# Altium schematic sheet MCU.SchDoc: Radio Pod - Microcontroller
size A4
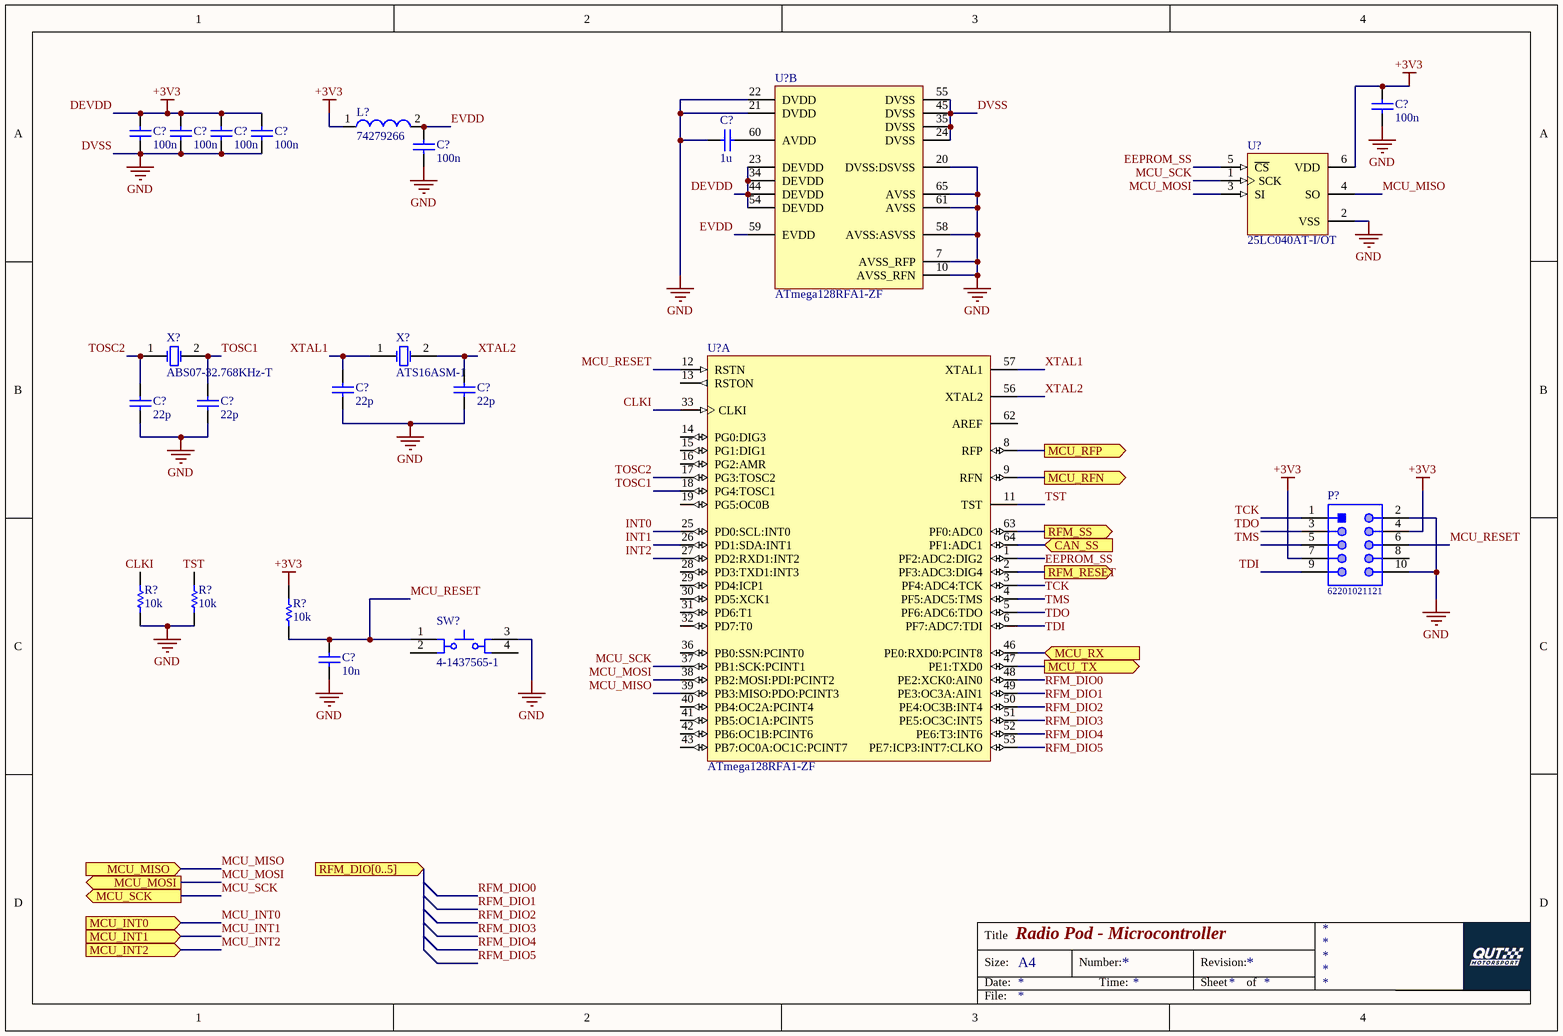
[diagram p0: MCU.SchDoc]

## Parts
(Parts that share a designator on the sheet are numbered #1, #2 ... from top to bottom, then left to right.)
C?#1  100n  [CAPC1608X90X35ML10T15]
C?#2  100n  [CAPC1608X90X35ML10T15]
C?#3  100n  [CAPC1608X90X35ML10T15]
C?#4  100n  [CAPC1608X90X35ML10T15]
C?#5  100n  [CAPC1608X90X35ML10T15]
C?#6  100n  [CAPC1608X90X35ML10T15]
C?#7  1u  [CAPC1608X90X35LL15T15]
C?#8  22p  [CAPC2013X88X50ML20T25]
C?#9  22p  [CAPC2013X88X50ML20T25]
C?#10  22p  [CAPC2013X88X50ML20T25]
C?#11  22p  [CAPC2013X88X50ML20T25]
C?#12  10n  [CAPC1005X56X25LL10T15]
L?  74279266  [SMD-0603]
P?  62201021121  [62201021121]
R?#1  10k  [RESC1609X55X30LL15T15]
R?#2  10k  [RESC1609X55X30LL15T15]
R?#3  10k  [RESC1609X55X30LL15T15]
SW?  4-1437565-1  [TECO-4-1437565-1_V]
U?#1  ATmega128RFA1-ZF  [64PI_N]  (part B of 2)
U?#2  25LC040AT-I/OT  [SOT-23-OT6_N]
U?#3  ATmega128RFA1-ZF  [64PI_N]  (part A of 2)
X?#1  ABS07-32.768KHz-T  [ABRA-ABS07-2_V]
X?#2  ATS16ASM-1  [CTS-ATS-SM-XTAL-2]

## Ports
CAN_SS (in), MCU_INT0 (in), MCU_INT1 (in), MCU_INT2 (in), MCU_MISO (in), MCU_MOSI (out), MCU_RFN (out), MCU_RFP (out), MCU_RX (in), MCU_SCK (out), MCU_TX (out), RFM_DIO[0..5] (in), RFM_RESET (out), RFM_SS (out)

## Nets
DEVDD: C?#1.1 C?#2.1 C?#3.1 C?#4.1 C?#5.1 L?.1 P?.4 P?.7 R?#3.1 U?#1.23(DEVDD) U?#1.34(DEVDD) U?#1.44(DEVDD) U?#1.54(DEVDD) U?#2.6(VDD)  [also labelled +3V3]
DVSS: C?#1.2 C?#2.2 C?#3.2 C?#4.2 C?#5.2 C?#6.2 C?#7.1 C?#8.2 C?#9.2 C?#10.2 C?#11.2 C?#12.2 P?.2 P?.10 R?#1.2 R?#2.2 SW?.3 U?#1.7(AVSS_RFP) U?#1.10(AVSS_RFN) U?#1.20(DVSS:DSVSS) U?#1.21(DVDD) U?#1.22(DVDD) U?#1.24(DVSS) U?#1.35(DVSS) U?#1.45(DVSS) U?#1.55(DVSS) U?#1.58(AVSS:ASVSS) U?#1.61(AVSS) U?#1.65(AVSS) U?#2.2(VSS)  [also labelled GND]
CAN_SS: U?#3.64(PF1:ADC1) ; port CAN_SS
CLKI: R?#1.1 U?#3.33(CLKI)
EEPROM_SS: U?#2.5(~{CS}) U?#3.1(PF2:ADC2:DIG2)
EVDD: C?#6.1 L?.2 U?#1.59(EVDD)
INT0: U?#3.25(PD0:SCL:INT0)
INT1: U?#3.26(PD1:SDA:INT1)
INT2: U?#3.27(PD2:RXD1:INT2)
MCU_INT0: port MCU_INT0
MCU_INT1: port MCU_INT1
MCU_INT2: port MCU_INT2
MCU_MISO: U?#2.4(SO) U?#3.39(PB3:MISO:PDO:PCINT3) ; port MCU_MISO
MCU_MOSI: U?#2.3(SI) U?#3.38(PB2:MOSI:PDI:PCINT2) ; port MCU_MOSI
MCU_RESET: C?#12.1 P?.6 R?#3.2 SW?.1 U?#3.12(RSTN)
MCU_RFN: U?#3.9(RFN) ; port MCU_RFN
MCU_RFP: U?#3.8(RFP) ; port MCU_RFP
MCU_RX: U?#3.46(PE0:RXD0:PCINT8) ; port MCU_RX
MCU_SCK: U?#2.1(SCK) U?#3.37(PB1:SCK:PCINT1) ; port MCU_SCK
MCU_TX: U?#3.47(PE1:TXD0) ; port MCU_TX
RFM_DIO0: U?#3.48(PE2:XCK0:AIN0)
RFM_DIO1: U?#3.49(PE3:OC3A:AIN1)
RFM_DIO2: U?#3.50(PE4:OC3B:INT4)
RFM_DIO3: U?#3.51(PE5:OC3C:INT5)
RFM_DIO4: U?#3.52(PE6:T3:INT6)
RFM_DIO5: U?#3.53(PE7:ICP3:INT7:CLKO)
RFM_RESET: U?#3.2(PF3:ADC3:DIG4) ; port RFM_RESET
RFM_SS: U?#3.63(PF0:ADC0) ; port RFM_SS
TCK: P?.1 U?#3.3(PF4:ADC4:TCK)
TDI: P?.9 U?#3.6(PF7:ADC7:TDI)
TDO: P?.3 U?#3.5(PF6:ADC6:TDO)
TMS: P?.5 U?#3.4(PF5:ADC5:TMS)
TOSC1: C?#11.1 U?#3.18(PG4:TOSC1) X?#1.2(X2)
TOSC2: C?#10.1 U?#3.17(PG3:TOSC2) X?#1.1(X1)
TST: R?#2.1 U?#3.11(TST)
XTAL1: C?#8.1 U?#3.57(XTAL1) X?#2.1(X1)
XTAL2: C?#9.1 U?#3.56(XTAL2) X?#2.2(X2)
NetC?#7_2: C?#7.2 U?#1.60(AVDD)

Not connected (* = marked no-connect by the designer): P? 8; SW? 2 4; U?#3 13(RSTON) 14(PG0:DIG3) 15(PG1:DIG1) 16(PG2:AMR) 19(PG5:OC0B) 28(PD3:TXD1:INT3) 29(PD4:ICP1) 30(PD5:XCK1) 31(PD6:T1) 32(PD7:T0) 36(PB0:SSN:PCINT0) 40(PB4:OC2A:PCINT4) 41(PB5:OC1A:PCINT5) 42(PB6:OC1B:PCINT6) 43(PB7:OC0A:OC1C:PCINT7) 62(AREF)

## Notes on the sheet
- Title
- Size:
- Date:
- A4
- Number:
- Time:
- Revision:
- Sheet
- of
- File:

## Library data of the parts
C?#1-C?#6 = CMP-2100-03643-1: Chip Capacitor, 0.1 uF, +/- 10%, 50 V, -55 to 125 degC, 0603 (1608 Metric), RoHS, Tape and Reel; Manufacturer: Murata; Dielectric Material: Ceramic; Voltage Rating: 50V; Capacitance: 100nF; Dielectric: X7R; Insulation Resistance: 10GR; Case Code (Metric): 1608; Lead Free: LeadFree; Depth: 0.8mm; Number of Pins: 2; Radiation Hardening: No; Case/Package: 0603; Manufacturer URL: http://www.murata.com/; Packaging: TapeandReel; Length: 1.6mm; Contact Plating: Tin; Datasheet URL: http://psearch.en.murata.com/capacitor/product/GRM188R71H104KA93%23.pdf; Tolerance: 10%; Case Code (Imperial): 0603; Min Operating Temperature: -55degC; RoHSCompliant: true; Voltage: 50V; Termination: SMD/SMT; Mount: SurfaceMount; Material: Ceramic; Package Quantity: 1; Height: 0.8mm; Thickness: 0.035inch; REACH SVHC: NoSVHC; Max Operating Temperature: 125degC; Width: 0.8mm; Package Reference: 0603; Voltage Rating (DC): 50V; Datasheet Version: 42675.0; Package Description: 2-Pin Surface Mount Device, Body 1.6 x 0.8 mm
C?#7 = CMP-2006-04532-1: Manufacturer: AVX Interconnect / Elco; Part Number: 0603YD105KAT2A
C?#8-C?#11 = CMP-2007-00448-1: Part Number: C0805C220J1GACTU; Manufacturer: Kemet
C?#12 = CMP-2008-02924-1: Part Number: 0402YC103KAT4A; Manufacturer: AVX Interconnect / Elco
L? = CMP-0220-00157-1: SMD EMI Suppression Ferrite Bead WE-CBF, Z = 1000 Ohm; PackageVersion: 2009; Impedance: 1000 Ohm; PackageDescription: Chip Inductor, 2-Leads, Body 1.6 x 0.8 mm; DatasheetVersion: Dec-2005; ComponentLink2Description: Datasheet; ComponentLink1URL: http://www.we-online.com; ComponentLink1Description: Manufacturer Link; ComponentLink2URL: http://www.we-online.de/katalog/media/pdf/74279266.pdf; PackageReference: SMD-0603
P? = CMP-1502-00948-1: THT Vertical Pin Header WR-PHD, Pitch 1.27 mm, Dual Row, 10 pins; Manufacturer: Wurth Elektronik; Rated Current: 1A; Pin Number: 10; Working Voltage: 100VAC; Contact Resistance: 20mOhm; Withstanding Voltage: 500VAC; Pitch: 1.27mm; Gender: Male; Mounting Technology: THT; Manufacturer URL: http://www.we-online.de; Package Reference: 62201021121; Row Number: Dual; Datasheet URL: https://katalog.we-online.de/em/datasheet/62201021121.pdf; Publisher: WurthElektronik; Packaging: Box; Operating Temperature: -40to105degC; Orientation: Vertical; Part Number: 62201021121
R?#1-R?#3 = CMP-2000-07452-1: Chip Resistor, 10 KOhm, +/- 1%, 0.1 W, -55 to 155 degC, 0603 (1608 Metric), RoHS, Tape and Reel; Manufacturer: Panasonic; Voltage Rating: 75V; Case\/Package: 0603; Power Rating: 100mW; Resistance: 10KOhm; Temperature Coefficient: 100ppm\/degreesC; Number of Pins: 2; Package Reference: 603; Depth: 0.8mm; Mount: SurfaceMount; Package Description: 2-Pin Surface Mount Device, Body 1.6 x 0.85 mm; Datasheet Version: 02/2017; Length: 1.6mm; Lead Free: LeadFree; Height: 0.45mm; Number of Terminations: 2; Max Power Dissipation: 100mW; Min Operating Temperature: -55degC; Datasheet URL: https://industrial.panasonic.com/cdbs/www-data/pdf/RDA0000/AOA0000C304.pdf; Termination: SMD/SMT; Case Code (Metric): 1608; Case Code (Imperial): 0603; Tolerance: 1%; Max Operating Temperature: 155degC; RoHSCompliant: true; Voltage Rating (DC): 75V; Radiation Hardening: No; Packaging: TapeandReel; Composition: ThickFilm; Mounting Technology: SurfaceMount; Manufacturer URL: http://www.panasonic.com/; Width: 0.031inch; REACH SVHC: NoSVHC; Contact Plating: Tin; Military Standard: Not; Package Quantity: 1
SW? = CMP-2000-05602-1: Tactile Switch, 50 mA, 12 VDC, -20 to 85 degC, 4-Pin SMD, RoHS, Bulk; Manufacturer: TEConnectivity/AMPBrand; Illumination Type: N/R; Maximum Contact Resistance: 100mOhm; Actuator Style: RoundButton; Actuator Length: 1.4mm; Contact Rating @ Voltage: 0.05@12VDCA; Maximum DC Voltage Rating: 12V; Body Orientation: Straight; Ground Terminal: No; Dielectric Strength: 500VAC; Operating Force: 1.57N; Electrical Life: 100000Cycle; Mechanical Life: N/A; Family: FSMJSMA; Contact Material: CopperAlloy; Type: N/A; RoHS: Yes; Pole Throw Configuration: N/A; Operating Temperature: -20to85C; Minimum Insulation Resistance: 100MOhm; Package Description: 4-Pin Surface Mount Device, Body 6 x 6 mm, Pitch 9.1 mm; Housing Material: N/A; Switch Configuration: N/A; Mounting: SurfaceMount,GullWing; Datasheet URL: https://datasheet.ciiva.com/14635/0900766b80912216-14635826.pdf; Packaging: Bulk; Base Material: N/A; Actuator Color: N/A; Dimension: 6x10x5.25mm; Contact Plating: Silver; Seal Location: N/A; Mounting Technology: SurfaceMount; Part No: 4-1437565-1; Seal Description: N/A; Maximum AC Voltage Rating: N/A; Datasheet Version: 04/2007; Manufacturer URL: http://www.te.com/; Package Reference: 4-1437565-1; Product Weight: N/A
U?#1 U?#3 = CMP-0295-00008-1: 8-bit AVR Microcontroller with Low Power 2.4GHz Transceiver for ZigBee and IEEE 802.15.4, 64-Pin VQFN (Sawn) (PI64), Industrial (-40°C to 125°C); Link Budget (dBm): 103.5; ADC Resolution (bits): 10; SRAM (Kbytes): 16; External PA Control: Yes; Crypto Engine: AES; ADC channels: 8; SPI: 1; EEPROM (Bytes): 4096; Timers: 6; Max Data Rate (Mb/s): 2; Receive Current Consumption (mA): 16.6; Max I/O Pins: 38; Max. Operating Frequency: 16 MHz; Power Output (dBm): 3.5; Flash (Kbytes): 128 Kbytes; Operating Voltage (Vcc): 1.8 to 3.6; Receiver Sensitivity (dBm): -100; Transmit Current Consumption (mA): 18.6; ComponentLink1URL: http://www.atmel.com/; PackageDescription: 64-Pin Quad Flat No-Lead (QFN), 9 x 9 mm Body, 0.5 mm Pitch, 5.65 x 4.75 mm Exposed Pad; PackageVersion: revA, Feb-2008; ComponentLink2URL: http://www.atmel.com/Images/doc8266.pdf; UART: 1; Antenna Diversity: Yes; DatasheetVersion: rev C, Oct-2011; Frequency Band: 2.4 GHz; Analog Comparators: 1; ComponentLink2Description: Datasheet; ComponentLink1Description: Manufacturer URL; TWI (I2C): 1; PackageReference: 64PI
U?#2 = CMP-0165-00264-1: 4K SPI Bus Serial EEPROM, 6-Pin SOT-23, Industrial Temperature, Tape and Reel; PackageVersion: revBB, Aug-2009; PackageReference: SOT-23-OT6; Code_IPC: SOT26A-6; PackageDescription: 6-Lead Plastic Small Outline Transistor (OT) [SOT-23]; DatasheetVersion: revF, Jul-2009
X?#1 = CMP-0447-00001-2: Crystal, 32.768 kHz, 12.5 pF, -40 to 85 degC, SMD Low Profile 3.2 x 1.5 x 0.9 mm, Tape and Reel; Manufacturer: Abracon; Q Value (Type): 30000; Operation Mode: Flexural Mode (Tuning Fork); Shunt Capacitance (C0): 0.9 to 1.2 pF; Load Capacitance (CL): 12.5 pF; Frequency Tolerance @+25degC: +/- 20 ppm; Drive Level (Type): 0.1 uW; Equivalent Series Resistance (R1): 70 Kohm; Insulation Resistance (Min): 500 Mohm; ComponentLink3URL: http://www.abracon.com/Resonators/ABS07.pdf; PackageDescription: 2-Pin Hand Drawn, Body 3.2x1.5mm, Pitch 2.5mm; Operating Temperature: -40 to 85 degC; ComponentLink2URL: http://www.abracon.com/Resonators/ABS07.pdf; PackageReference: ABS07-2; ComponentLink3Description: Package Specification; ComponentLink1Description: Manufacturer URL; DatasheetVersion: 04.03.13; Mounting Technology: Surface Mount; ComponentLink2Description: Datasheet; ComponentLink1URL: http://www.abracon.com/; PartNumber: ABS07-32.768KHz-T; Packing: Tape and Reel; Frequency: 32.768 kHz
X?#2 = CMP-0585-00002-2: ATS-SM Series Quartz Crystal, 16 MHz, -20 to 70 degC, 11.1 x 4.83 x 4.3mm SMD, RoHS, Tape and Reel; Manufacturer: CTS Corporation; Shunt Capacitance (C0): 7.0 pF Max; Frequency: 16 MHz; Oscillation Mode: Fundamental or 3rd Overtone; Crystal Cut: AT-Cut; ESR Maximum: 40 Ohms; Drive Level (Type): 100 uW; PackageDescription: 2-Pin SMD, Body 11.1 x 4.83 mm, Pitch 8.5 mm; PackageReference: ATS-SM-XTAL-2; ComponentLink1URL: http://www.ctscorp.com/; PartNumber: ATS16ASM-1; RoHS: TRUE; ComponentLink1Description: Manufacturer URL; Operating Temperature: -20 to 70 degC; DatasheetVersion: Rev. K; ComponentLink2Description: Datasheet; Packing: Tape and Reel; ComponentLink2URL: http://www.ctscorp.com/components/Datasheets/008-0309-0.pdf; Mounting Technology: Surface Mount; ComponentLink3URL: http://www.ctscorp.com/components/Datasheets/008-0309-0.pdf; ComponentLink3Description: Package Specification